# EAGLE schematic PCB_schematic (EAGLE 9.6.2)
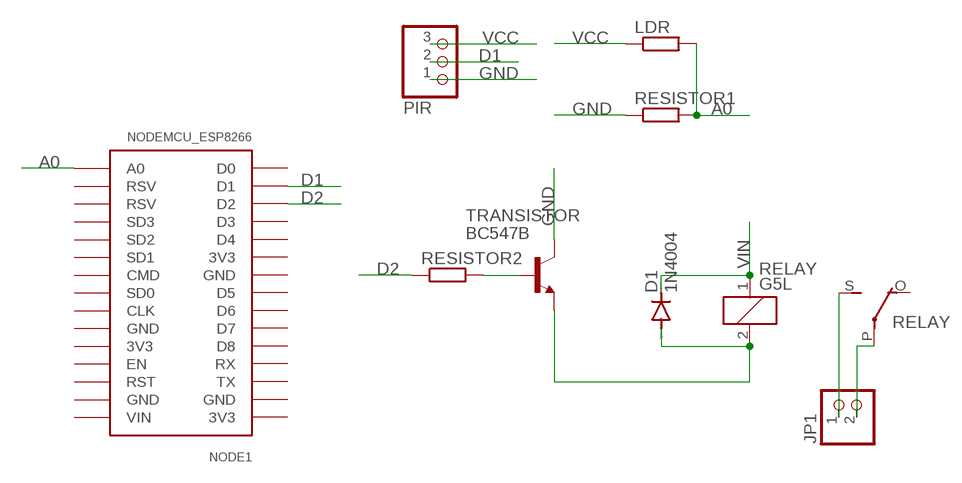
[diagram p0: schematic, sheet 1]

## Parts
D1  1N4004  [DO41-10]
JP1  PINHD-1X2  [1X02]
LDR  R-EU_0204/7  [0204/7]
NODE1  NODEMCU_ESP8266  [NODEMCU_ESP8266]
PIR  PINHD-1X3  [1X03]
RELAY  G5L  [G5LE]
RESISTOR1  R-EU_0204/7  [0204/7]
RESISTOR2  R-EU_0204/7  [0204/7]
TRANSISTOR  BC547B  [TO92]

## Nets
A0: LDR.2 NODE1.A0 RESISTOR1.2
D1: NODE1.D1 PIR.2
D2: NODE1.D2 RESISTOR2.1
GND: PIR.1 RESISTOR1.1 TRANSISTOR.3(C)
N$1: JP1.1 RELAY.S(2:S)
N$2: D1.A RELAY.2 TRANSISTOR.1(E)
N$3: RESISTOR2.2 TRANSISTOR.2(B)
N$4: JP1.2 RELAY.P(2:P)
VCC: LDR.1 PIR.3
VIN: D1.C RELAY.1
Unconnected: NODE1.CLK NODE1.CMD NODE1.D0 NODE1.D3 NODE1.D4 NODE1.D5 NODE1.D6 NODE1.D7 NODE1.D8 NODE1.EN NODE1.RST NODE1.RSV1(RSV) NODE1.RSV2(RSV) NODE1.RX NODE1.SD1 NODE1.SD2 NODE1.SD3 NODE1.SDO(SD0) NODE1.TX RELAY.O(2:O)

## Power pins joined to a net without a drawn wire
3V3: NODE1.3V3@1(3V3) NODE1.3V3@2(3V3) NODE1.3V3@3(3V3)
GND: NODE1.GND@1(GND) NODE1.GND@2(GND) NODE1.GND@3(GND) NODE1.GND@4(GND)
VIN: NODE1.VIN

## Library data of the parts
D1 = diode:1N4004: DIODE general purpose rectifier, 1 A
JP1 = pinhead:PINHD-1X2: PIN HEADER
LDR RESISTOR1 RESISTOR2 = rcl:R-EU_: RESISTOR, European symbol; SPICEPREFIX: R
NODE1 = nodemcu_esp8266:NODEMCU_ESP8266: Node MCU V2 (ESP8266) Created by Harish
PIR = pinhead:PINHD-1X3: PIN HEADER
RELAY = relay:G5L: RELAY 1 x switch, 10 A/120 V AC, 8 A/30 V ADC, Omron; OC_FARNELL: unknown; OC_NEWARK: unknown
TRANSISTOR = transistor-npn:BC547*: NPN Transistor